# Altium project Power_Box_V2.PrjPcb (part 2 of 2)

## Sheet ISD1730.SchDoc
size A; SheetNumber: 5; SheetTotal: 13
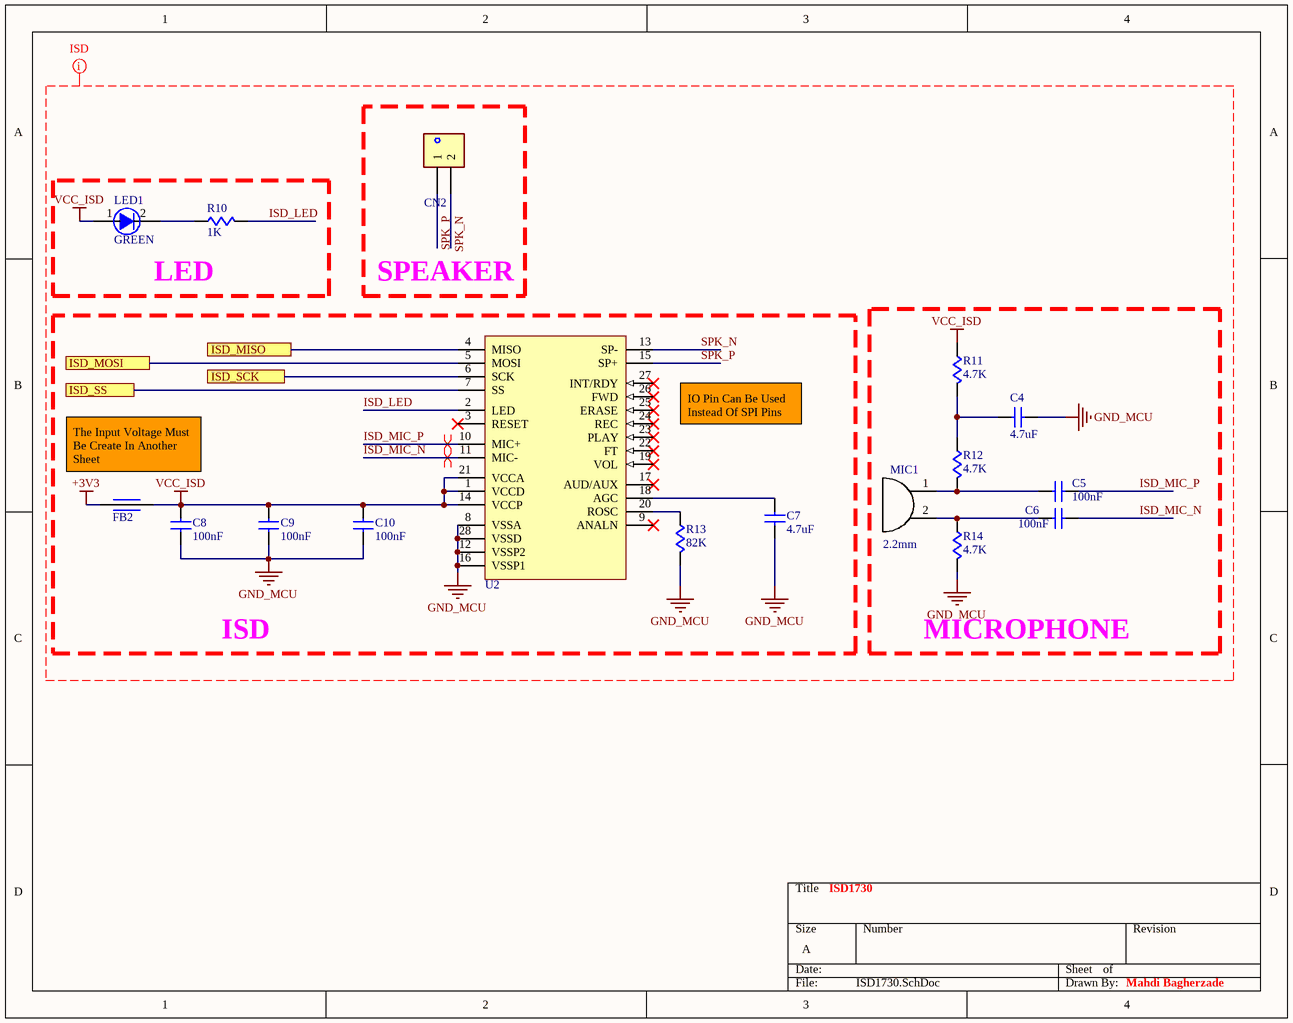
[diagram p10: ISD1730.SchDoc]

### Parts
C4  value 4.7uF  [C-0805]  (hidden comment: CAP Cer 4.7uF-50V-X7R-SMD)
C5  value 100nF  [C-0805]  (hidden comment: CAP Cer 100nF-50V-X7R-SMD)
C6  value 100nF  [C-0805]  (hidden comment: CAP Cer 100nF-50V-X7R-SMD)
C7  value 4.7uF  [C-0805]  (hidden comment: CAP Cer 4.7uF-50V-X7R-SMD)
C8  value 100nF  [C-0805]  (hidden comment: CAP Cer 100nF-50V-X7R-SMD)
C9  value 100nF  [C-0805]  (hidden comment: CAP Cer 100nF-50V-X7R-SMD)
C10  value 100nF  [C-0805]  (hidden comment: CAP Cer 100nF-50V-X7R-SMD)
CN2  Connector XH-2-Straight-THD-2.54mm  [XH-2]  (value not drawn)
FB2  Ferrite Bead SMD  [FB-0805]  (value not drawn)
LED1  Color: GREEN  [LED-1206-Y]  (hidden comment: LED GREEN-1206-SMD)
MIC1  Size: 2.2mm  [MIC-2.2mm]  (hidden comment: Mic 2.2mm-THD)
R10  value 1K  [R-0805]  (hidden comment: RES 1K-5%-1/8W-SMD)
R11  value 4.7K  [R-0805]  (hidden comment: RES 4.7K-5%-1/8W-SMD)
R12  value 4.7K  [R-0805]  (hidden comment: RES 4.7K-5%-1/8W-SMD)
R13  value 82K  [R-0805]  (hidden comment: RES 82K-5%-1/8W-SMD)
R14  value 4.7K  [R-0805]  (hidden comment: RES 4.7K-5%-1/8W-SMD)
U2  IC ISD1730-SMD  [SOIC28-wide]  (value not drawn)

### Blocks framed on the sheet
SPEAKER: CN2
LED: LED1 R10
ISD: C7-C10 FB2 R13 U2
MICROPHONE: C4-C6 MIC1 R11 R12 R14

### Ports
ISD_MISO (see Interface[3B]), ISD_MOSI (see Interface[3B]), ISD_SCK (see Interface[3B]), ISD_SS (see Interface[3B], MCU[3C])

### Nets
+3V3: FB2.1
GND_MCU: C4.2 C7.2 C8.2 C9.2 C10.2 R13.2 R14.2 U2.8(VSSA) U2.12(VSSP2) U2.16(VSSP1) U2.28(VSSD)
VCC_ISD: C8.1 C9.1 C10.1 FB2.2 LED1.1(A) R11.1 U2.1(VCCD) U2.14(VCCP) U2.21(VCCA)
ISD_LED: R10.2 U2.2(LED)
ISD_MIC_N: C6.2 U2.11(MIC-)
ISD_MIC_P: C5.2 U2.10(MIC+)
SPK_N: CN2.2 U2.13(SP-)
SPK_P: CN2.1 U2.15(SP+)
NetC4_1: C4.1 R11.2 R12.1
NetC5_1: C5.1 MIC1.1 R12.2
NetC6_1: C6.1 MIC1.2 R14.1
NetC7_1: C7.1 U2.18(AGC)
NetLED1_2: LED1.2(C) R10.1
NetR13_1: R13.1 U2.20(ROSC)
NetU2_4: U2.4(MISO) ; port ISD_MISO
NetU2_5: U2.5(MOSI) ; port ISD_MOSI
NetU2_6: U2.6(SCK) ; port ISD_SCK
NetU2_7: U2.7(SS) ; port ISD_SS

Not connected (* = marked no-connect by the designer): U2 3(RESET)* 9(ANALN)* 17(AUD/AUX)* 19(VOL)* 22(FT)* 23(PLAY)* 24(REC)* 25(ERASE)* 26(FWD)* 27(INT/RDY)*

### Layout directives
differential pair: ISD_MIC_N, ISD_MIC_P
net class ISD: +3V3, GND_MCU, ISD_LED, ISD_MIC_N, ISD_MIC_P, SPK_N, SPK_P, VCC_ISD

### Notes on the sheet
- IO Pin Can Be Used Instead Of SPI Pins
- The Input Voltage Must Be Create In Another Sheet
- ISD1730
- Mahdi Bagherzade

### Library data of the parts
C4-C10 = CAP-CER: CAPACITOR; Phone Number: 0915 8700 314; Voltage: 50V; Tolerance: X7R; Type: SMD; Publisher: Mahdi Bagherzadeh; ComponentLink1Description: Linkedin; ComponentLink1URL: https://ir.linkedin.com/in/mahdi-bagherzade; Published Date: 9-15-2024
CN2 = CN-2pin: CONNECTOR; Phone Number: 0915 8700 314; Value: XH-2; Publisher: Mahdi Bagherzadeh; ComponentLink1Description: Linkedin; ComponentLink1URL: https://ir.linkedin.com/in/mahdi-bagherzade; Published Date: 9-15-2024; Size: 2.54mm; Type: Straight-THD
FB2 = FERRITE BEAD: INDUCATOR; Phone Number: 0915 8700 314; Publisher: Mahdi Bagherzadeh; ComponentLink1Description: Linkedin; ComponentLink1URL: https://ir.linkedin.com/in/mahdi-bagherzade; Published Date: 9-15-2024; Type: SMD
LED1 = LED: Phone Number: 0915 8700 314; Type: SMD; Publisher: Mahdi Bagherzadeh; ComponentLink1Description: Linkedin; ComponentLink1URL: https://ir.linkedin.com/in/mahdi-bagherzade; Published Date: 9-15-2024; Size: 1206
MIC1 = MIC: Phone Number: 0915 8700 314; Publisher: Mahdi Bagherzadeh; ComponentLink1Description: Linkedin; ComponentLink1URL: https://ir.linkedin.com/in/mahdi-bagherzade; Published Date: 9-15-2024; Type: THD
R10-R14 = RES: RESISTOR; Phone Number: 0915 8700 314; Power: 1/8W; Tolerance: 5%; Publisher: Mahdi Bagherzadeh; ComponentLink1Description: Linkedin; ComponentLink1URL: https://ir.linkedin.com/in/mahdi-bagherzade; Published Date: 9-15-2024; Type: SMD
U2 = ISD1730: IC; Phone Number: 0915 8700 314; Publisher: Mahdi Bagherzadeh; ComponentLink1Description: Linkedin; ComponentLink1URL: https://ir.linkedin.com/in/mahdi-bagherzade; Published Date: 9-15-2024; Code: ISD1730; Type: SMD

## Sheet IS42S16400J.SchDoc
size A; SheetNumber: 11; SheetTotal: 12
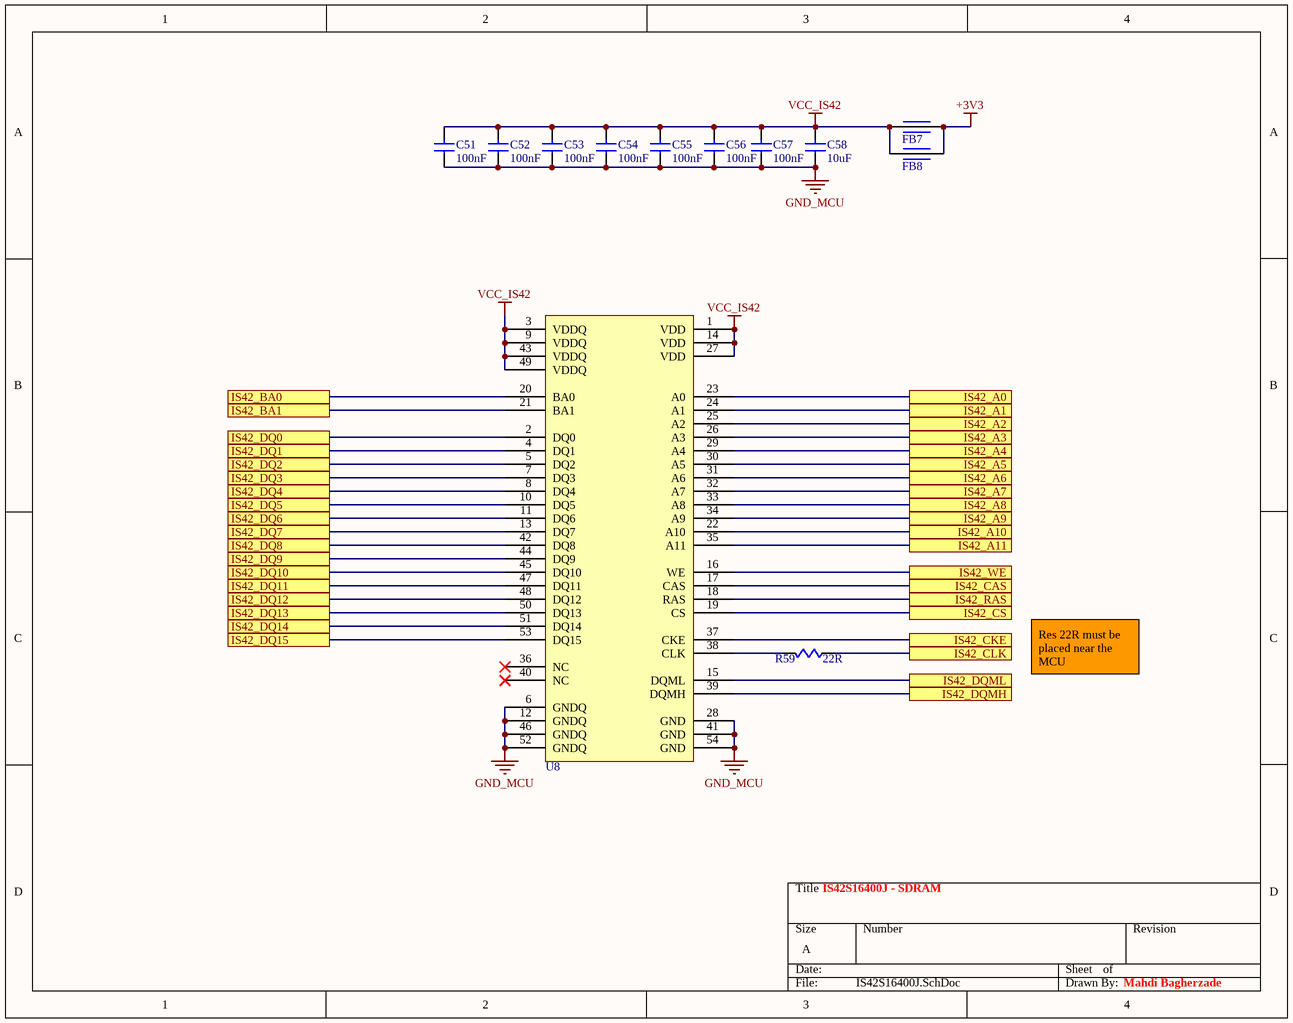
[diagram p11: IS42S16400J.SchDoc]

### Parts
C51  value 100nF  [C-0805]  (hidden comment: CAP Cer 100nF-50V-X7R-SMD)
C52  value 100nF  [C-0805]  (hidden comment: CAP Cer 100nF-50V-X7R-SMD)
C53  value 100nF  [C-0805]  (hidden comment: CAP Cer 100nF-50V-X7R-SMD)
C54  value 100nF  [C-0805]  (hidden comment: CAP Cer 100nF-50V-X7R-SMD)
C55  value 100nF  [C-0805]  (hidden comment: CAP Cer 100nF-50V-X7R-SMD)
C56  value 100nF  [C-0805]  (hidden comment: CAP Cer 100nF-50V-X7R-SMD)
C57  value 100nF  [C-0805]  (hidden comment: CAP Cer 100nF-50V-X7R-SMD)
C58  value 10uF  [C-0805]  (hidden comment: CAP Cer 10uF-50V-X7R-SMD)
FB7  Ferrite Bead SMD  [FB-0805]  (value not drawn)
FB8  Ferrite Bead SMD  [FB-0805]  (value not drawn)
R59  value 22R  [R-0805]  (hidden comment: RES 22R-5%-1/8W-SMD)
U8  IC IS42S16400J-7TLI-SMD  [TSSOP-54]  (value not drawn)

### Ports
IS42_A0 (see Interface[3C], MCU[5B]), IS42_A1 (see Interface[3C], MCU[5B]), IS42_A2 (see Interface[3D], MCU[5B]), IS42_A3 (see Interface[3D], MCU[5B]), IS42_A4 (see Interface[3D], MCU[5B]), IS42_A5 (see Interface[3D], MCU[5B]), IS42_A6 (see Interface[3D], MCU[5C]), IS42_A7 (see Interface[3D], MCU[5C]), IS42_A8 (see Interface[3D], MCU[5C]), IS42_A9 (see Interface[3D], MCU[5C]), IS42_A10 (see Interface[3D], MCU[3C]), IS42_A11 (see Interface[3D], MCU[3C]), IS42_BA0 (see Interface[3C], MCU[3C]), IS42_BA1 (see Interface[3C], MCU[3C]), IS42_CAS (see Interface[3D], MCU[3C]), IS42_CKE (see Interface[3D], MCU[3B]), IS42_CLK (see Interface[3D], MCU[3C]), IS42_CS (see Interface[3D], MCU[3B]), IS42_DQ0 (see Interface[3C], MCU[5B]), IS42_DQ1 (see Interface[3C], MCU[5B]), IS42_DQ2 (see Interface[3C], MCU[5A]), IS42_DQ3 (see Interface[3C], MCU[5A]), IS42_DQ4 (see Interface[3C], MCU[3B]), IS42_DQ5 (see Interface[3C], MCU[3C]), IS42_DQ6 (see Interface[3C], MCU[3C]), IS42_DQ7 (see Interface[3C], MCU[3C]), IS42_DQ8 (see Interface[3C], MCU[3C]), IS42_DQ9 (see Interface[3C], MCU[3C]), IS42_DQ10 (see Interface[3C], MCU[3C]), IS42_DQ11 (see Interface[3C], MCU[3C]), IS42_DQ12 (see Interface[3C], MCU[3C]), IS42_DQ13 (see Interface[3C], MCU[5B]), IS42_DQ14 (see Interface[3C], MCU[5B]), IS42_DQ15 (see Interface[3C], MCU[5B]), IS42_DQMH (see Interface[3D], MCU[3B]), IS42_DQML (see Interface[3D], MCU[3B]), IS42_RAS (see Interface[3D], MCU[5C]), IS42_WE (see Interface[3D], MCU[3A])

### Nets
+3V3: FB7.1 FB8.1
GND_MCU: C51.1 C52.1 C53.1 C54.1 C55.1 C56.1 C57.1 C58.1 U8.6(GNDQ) U8.12(GNDQ) U8.28(GND) U8.41(GND) U8.46(GNDQ) U8.52(GNDQ) U8.54(GND)
VCC_IS42: C51.2 C52.2 C53.2 C54.2 C55.2 C56.2 C57.2 C58.2 FB7.2 FB8.2 U8.1(VDD) U8.3(VDDQ) U8.9(VDDQ) U8.14(VDD) U8.27(VDD) U8.43(VDDQ) U8.49(VDDQ)
NetR59_1: R59.1 ; port IS42_CLK
NetR59_2: R59.2 U8.38(CLK)
NetU3_10: U8.23(A0) ; port IS42_A0
NetU3_11: U8.24(A1) ; port IS42_A1
NetU3_12: U8.25(A2) ; port IS42_A2
NetU3_13: U8.26(A3) ; port IS42_A3
NetU3_14: U8.29(A4) ; port IS42_A4
NetU3_15: U8.30(A5) ; port IS42_A5
NetU3_26: U8.16(WE) ; port IS42_WE
NetU3_28: U8.19(CS) ; port IS42_CS
NetU3_29: U8.37(CKE) ; port IS42_CKE
NetU3_49: U8.18(RAS) ; port IS42_RAS
NetU3_50: U8.31(A6) ; port IS42_A6
NetU3_53: U8.32(A7) ; port IS42_A7
NetU3_54: U8.33(A8) ; port IS42_A8
NetU3_55: U8.34(A9) ; port IS42_A9
NetU3_56: U8.22(A10) ; port IS42_A10
NetU3_57: U8.35(A11) ; port IS42_A11
NetU3_58: U8.8(DQ4) ; port IS42_DQ4
NetU3_59: U8.10(DQ5) ; port IS42_DQ5
NetU3_60: U8.11(DQ6) ; port IS42_DQ6
NetU3_63: U8.13(DQ7) ; port IS42_DQ7
NetU3_64: U8.42(DQ8) ; port IS42_DQ8
NetU3_65: U8.44(DQ9) ; port IS42_DQ9
NetU3_66: U8.45(DQ10) ; port IS42_DQ10
NetU3_67: U8.47(DQ11) ; port IS42_DQ11
NetU3_68: U8.48(DQ12) ; port IS42_DQ12
NetU3_77: U8.50(DQ13) ; port IS42_DQ13
NetU3_78: U8.51(DQ14) ; port IS42_DQ14
NetU3_79: U8.53(DQ15) ; port IS42_DQ15
NetU3_85: U8.2(DQ0) ; port IS42_DQ0
NetU3_86: U8.4(DQ1) ; port IS42_DQ1
NetU3_89: U8.21(BA1) ; port IS42_BA1
NetU3_90: U8.20(BA0) ; port IS42_BA0
NetU3_114: U8.5(DQ2) ; port IS42_DQ2
NetU3_115: U8.7(DQ3) ; port IS42_DQ3
NetU3_132: U8.17(CAS) ; port IS42_CAS
NetU3_141: U8.15(DQML) ; port IS42_DQML
NetU3_142: U8.39(DQMH) ; port IS42_DQMH

Not connected (* = marked no-connect by the designer): U8 36(NC)* 40(NC)*

### Notes on the sheet
- Res 22R must be placed near the MCU
- IS42S16400J - SDRAM
- Mahdi Bagherzade

### Library data of the parts
C51-C58 = CAP-CER: as C4 on sheet ISD1730; Publisher: Mahdi Bagherzadeh; ComponentLink1Description: Linkedin; ComponentLink1URL: https://ir.linkedin.com/in/mahdi-bagherzade; Published Date: 9-15-2024
FB7 FB8 = FERRITE BEAD: INDUCATOR; Phone Number: 0915 8700 314; Publisher: Mahdi Bagherzadeh; ComponentLink1Description: Linkedin; ComponentLink1URL: https://ir.linkedin.com/in/mahdi-bagherzade; Published Date: 9-15-2024; Type: SMD
R59 = RES: as R10 on sheet ISD1730; Publisher: Mahdi Bagherzadeh; ComponentLink1Description: Linkedin; ComponentLink1URL: https://ir.linkedin.com/in/mahdi-bagherzade; Published Date: 9-15-2024; Type: SMD
U8 = IS42S16400J-7TLI: IC; Phone Number: 0915 8700 314; Publisher: Mahdi Bagherzadeh; ComponentLink1Description: Linkedin; ComponentLink1URL: https://ir.linkedin.com/in/mahdi-bagherzade; Published Date: 9-15-2024; Code: IS42S16400J-7TLI; Type: SMD

## Sheet Touch XPT2046.SchDoc
size A; SheetNumber: 12; SheetTotal: 13
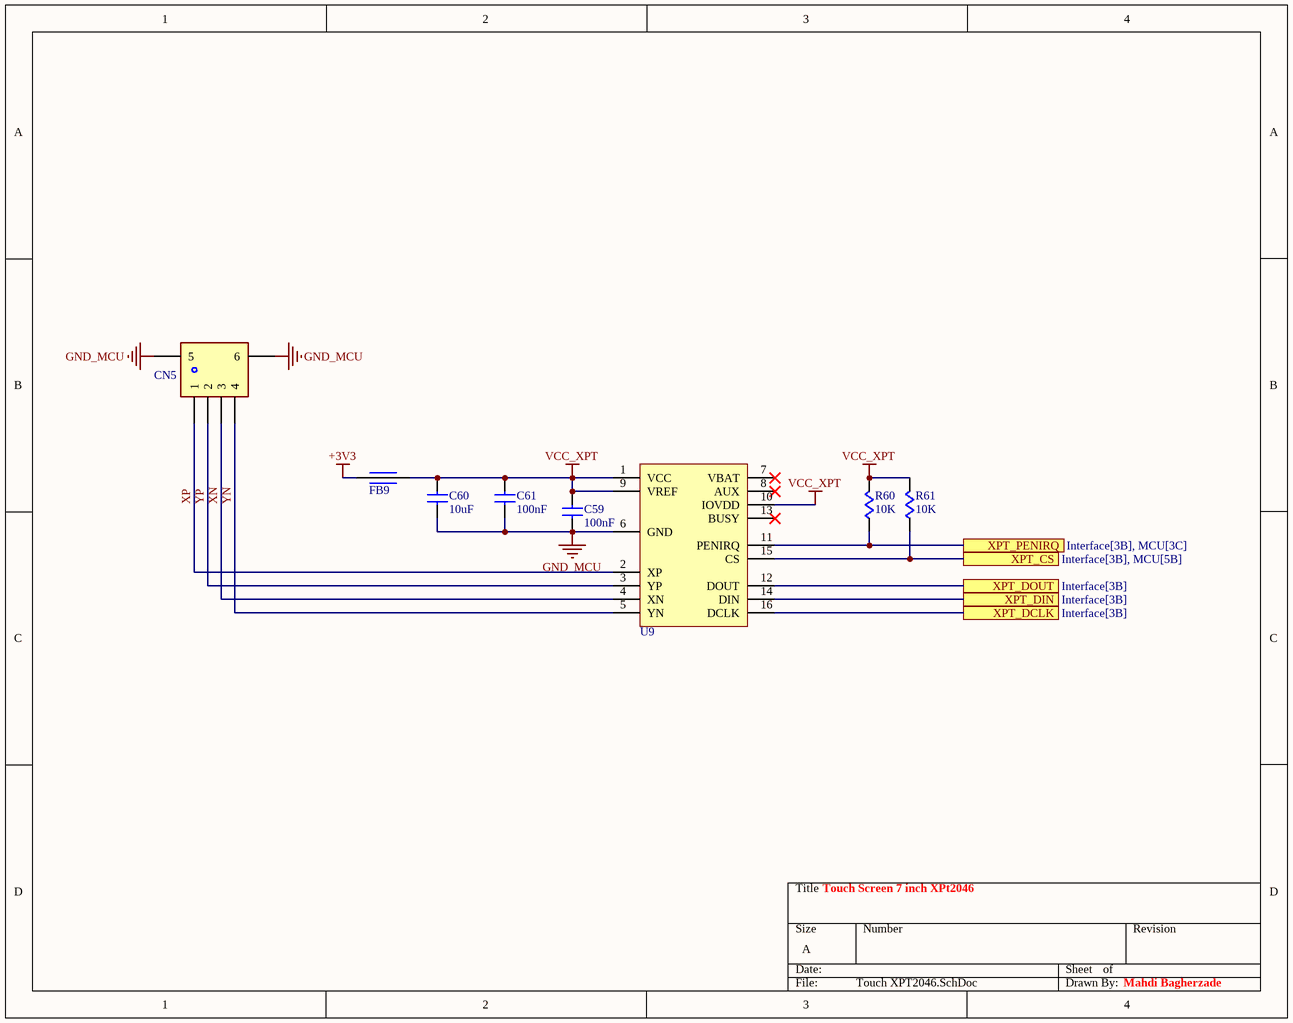
[diagram p12: Touch XPT2046.SchDoc]

### Parts
C59  value 100nF  [C-0805]  (hidden comment: CAP Cer 100nF-50V-X7R-SMD)
C60  value 10uF  [C-0805]  (hidden comment: CAP Cer 10uF-50V-X7R-SMD)
C61  value 100nF  [C-0805]  (hidden comment: CAP Cer 100nF-50V-X7R-SMD)
CN5  Connector FPC Right-1mm-4 Pin  [CN-FPC-4-1mm-hor]  (value not drawn)
FB9  Ferrite Bead SMD  [FB-0805]  (value not drawn)
R60  value 10K  [R-0805]  (hidden comment: RES 10K-5%-1/8W-SMD)
R61  value 10K  [R-0805]  (hidden comment: RES 10K-5%-1/8W-SMD)
U9  IC XPT2046-SMD  [TSSOP-16]  (value not drawn)

### Ports
XPT_CS (see Interface[3B], MCU[5B]), XPT_DCLK (see Interface[3B]), XPT_DIN (see Interface[3B]), XPT_DOUT (see Interface[3B]), XPT_PENIRQ (see Interface[3B], MCU[3C])

### Nets
+3V3: FB9.1
GND_MCU: C59.2 C60.2 C61.2 CN5.5 CN5.6 U9.6(GND)
VCC_XPT: C59.1 C60.1 C61.1 FB9.2 R60.2 R61.2 U9.1(VCC) U9.9(VREF) U9.10(IOVDD)
XN: CN5.3 U9.4(XN)
XP: CN5.1 U9.2(XP)
YN: CN5.4 U9.5(YN)
YP: CN5.2 U9.3(YP)
NetR60_1: R60.1 U9.11(PENIRQ) ; port XPT_PENIRQ
NetR61_1: R61.1 U9.15(CS) ; port XPT_CS
NetU2_4: U9.12(DOUT) ; port XPT_DOUT
NetU2_5: U9.14(DIN) ; port XPT_DIN
NetU2_6: U9.16(DCLK) ; port XPT_DCLK

Not connected (* = marked no-connect by the designer): U9 7(VBAT)* 8(AUX)* 13(BUSY)*

### Notes on the sheet
- Touch Screen 7 inch XPt2046
- Mahdi Bagherzade

### Library data of the parts
C59-C61 = CAP-CER: as C4 on sheet ISD1730; Publisher: Mahdi Bagherzadeh; ComponentLink1Description: Linkedin; ComponentLink1URL: https://ir.linkedin.com/in/mahdi-bagherzade; Published Date: 9-15-2024
CN5 = CN-FPC-4pin: CONNECTOR; Phone Number: 0915 8700 314; Publisher: Mahdi Bagherzadeh; ComponentLink1Description: Linkedin; ComponentLink1URL: https://ir.linkedin.com/in/mahdi-bagherzade; Published Date: 9-15-2024; Size: 1mm-4 Pin; Type: Right
FB9 = FERRITE BEAD: INDUCATOR; Phone Number: 0915 8700 314; Publisher: Mahdi Bagherzadeh; ComponentLink1Description: Linkedin; ComponentLink1URL: https://ir.linkedin.com/in/mahdi-bagherzade; Published Date: 9-15-2024; Type: SMD
R60 R61 = RES: as R10 on sheet ISD1730; Publisher: Mahdi Bagherzadeh; ComponentLink1Description: Linkedin; ComponentLink1URL: https://ir.linkedin.com/in/mahdi-bagherzade; Published Date: 9-15-2024; Type: SMD
U9 = XPT2046: IC; Phone Number: 0915 8700 314; Publisher: Mahdi Bagherzadeh; ComponentLink1Description: Linkedin; ComponentLink1URL: https://ir.linkedin.com/in/mahdi-bagherzade; Published Date: 9-15-2024; Code: XPT2046; Type: SMD

## Nets that join several sheets
+3V3: STM32_AUX (6 pins), LCD TFT 50 Pin (FB3.1), W25Q32 (FB6.1), EEPROM (FB1.2), KEY1 (R1A.1), KEY2 (R1B.1), ISD1730 (FB2.1), IS42S16400J (FB7.1 FB8.1), Touch XPT2046 (FB9.1)
+5: Interface (C41.1 C42.1 CN4.3), STM32_AUX (C33.2 C34.2 U4.1), Power (C44.1 C46.1 LED4.1 U5.3), MC3202 (C47.1 L1.1 U6.6)
+12: Power (C43.1 C45.1 D3.2 U5.1), CHANNEL1 (CN1A.3 D1A.2 R6A.1), CHANNEL2 (CN1B.3 D1B.2 R6B.1), CHANNEL3 (CN1C.3 D1C.2 R6C.1), CHANNEL4 (CN1D.3 D1D.2 R6D.1), CHANNEL5 (CN1E.3 D1E.2 R6E.1), CHANNEL6 (CN1F.3 D1F.2 R6F.1), CHANNEL7 (CN1G.3 D1G.2 R6G.1), CHANNEL8 (CN1H.3 D1H.2 R6H.1)
GND: Interface (NT1.1), MC3202 (6 pins)
GND_MCU: Interface (6 pins), MCU (10 pins), STM32_AUX (32 pins), LCD TFT 50 Pin (18 pins), W25Q32 (C50.1 U7.4), EEPROM (6 pins), KEY1 (C1A.2 S1A.1), KEY2 (C1B.2 S1B.1), Power (7 pins), CHANNEL1 (7 pins), CHANNEL2 (7 pins), CHANNEL3 (7 pins), CHANNEL4 (7 pins), CHANNEL5 (7 pins), CHANNEL6 (7 pins), CHANNEL7 (7 pins), CHANNEL8 (7 pins), MC3202 (C49.2), ISD1730 (11 pins), IS42S16400J (15 pins), Touch XPT2046 (6 pins)
VCC_MCU: MCU (15 pins), STM32_AUX (19 pins)
LTDC_B2: MCU (U3.122), LCD TFT 50 Pin (CN3.17)
LTDC_B3: MCU (U3.126), LCD TFT 50 Pin (CN3.16)
LTDC_B4: MCU (U3.127), LCD TFT 50 Pin (CN3.15)
LTDC_B5: MCU (U3.37), LCD TFT 50 Pin (CN3.14)
LTDC_B6: MCU (U3.139), LCD TFT 50 Pin (CN3.13)
LTDC_B7: MCU (U3.140), LCD TFT 50 Pin (CN3.12)
LTDC_CLK: MCU (U3.92), LCD TFT 50 Pin (R43.1)
LTDC_DE: MCU (U3.22), LCD TFT 50 Pin (R16.1)
LTDC_G2: MCU (U3.42), LCD TFT 50 Pin (CN3.25)
LTDC_G3: MCU (U3.125), LCD TFT 50 Pin (CN3.24)
LTDC_G4: MCU (U3.69), LCD TFT 50 Pin (CN3.23)
LTDC_G5: MCU (U3.70), LCD TFT 50 Pin (CN3.22)
LTDC_G6: MCU (U3.97), LCD TFT 50 Pin (CN3.21)
LTDC_G7: MCU (U3.117), LCD TFT 50 Pin (CN3.20)
LTDC_HSYNC: MCU (U3.96), LCD TFT 50 Pin (R18.1)
LTDC_R2: MCU (U3.111), LCD TFT 50 Pin (CN3.33)
LTDC_R3: MCU (U3.46), LCD TFT 50 Pin (CN3.32)
LTDC_R4: MCU (U3.103), LCD TFT 50 Pin (CN3.31)
LTDC_R5: MCU (U3.104), LCD TFT 50 Pin (CN3.30)
LTDC_R6: MCU (U3.47), LCD TFT 50 Pin (CN3.29)
LTDC_R7: MCU (U3.91), LCD TFT 50 Pin (CN3.28)
LTDC_RST: MCU (U3.98), LCD TFT 50 Pin (C11.2 R44.1 R45.1)
LTDC_VSYNC: MCU (U3.40), LCD TFT 50 Pin (R17.1)
MCU_BOOT0: MCU (U3.138), STM32_AUX (H2.2)
MCU_BOOT1: MCU (U3.48), STM32_AUX (H3.2)
MCU_NRST: MCU (U3.25), STM32_AUX (C15.2 R46.1 S2.2)
MCU_OCS_N: MCU (U3.23), STM32_AUX (C16.2 Y1.1)
MCU_OCS_P: MCU (U3.24), STM32_AUX (C17.2 Y1.2)
MCU_RXD: Interface (CN4.4), MCU (U3.102)
MCU_SCL: MCU (U3.100), EEPROM (R8.2 U1.6)
MCU_SDA: MCU (U3.99), EEPROM (R9.2 U1.5)
MCU_SWCLK: MCU (U3.109), STM32_AUX (H1.3)
MCU_SWDIO: MCU (U3.105), STM32_AUX (H1.1)
MCU_TXD: Interface (CN4.5), MCU (U3.101)
MCU_VBAT: MCU (U3.6), STM32_AUX (BAT1.1 C38.2 C39.2 D2.2)
NetLED3_1: Interface (LED3.1), MCU (U3.5)
NetR56_1: MCU (U3.129), W25Q32 (R56.1 U7.1)
NetR59_1: MCU (U3.93), IS42S16400J (R59.1)
NetR60_1: MCU (U3.124), Touch XPT2046 (R60.1 U9.11)
NetR61_1: MCU (U3.123), Touch XPT2046 (R61.1 U9.15)
NetU2_4: MCU (U3.134), W25Q32 (U7.2), ISD1730 (U2.4), Touch XPT2046 (U9.12)
NetU2_5: MCU (U3.135), W25Q32 (U7.5), ISD1730 (U2.5), Touch XPT2046 (U9.14)
NetU2_6: MCU (U3.133), W25Q32 (U7.6), ISD1730 (U2.6), Touch XPT2046 (U9.16)
NetU2_7: MCU (U3.128), ISD1730 (U2.7)
NetU3_10: MCU (U3.10), IS42S16400J (U8.23)
NetU3_11: MCU (U3.11), IS42S16400J (U8.24)
NetU3_12: MCU (U3.12), IS42S16400J (U8.25)
NetU3_13: MCU (U3.13), IS42S16400J (U8.26)
NetU3_14: MCU (U3.14), IS42S16400J (U8.29)
NetU3_15: MCU (U3.15), IS42S16400J (U8.30)
NetU3_26: MCU (U3.26), IS42S16400J (U8.16)
NetU3_28: MCU (U3.28), IS42S16400J (U8.19)
NetU3_29: MCU (U3.29), IS42S16400J (U8.37)
NetU3_49: MCU (U3.49), IS42S16400J (U8.18)
NetU3_50: MCU (U3.50), IS42S16400J (U8.31)
NetU3_53: MCU (U3.53), IS42S16400J (U8.32)
NetU3_54: MCU (U3.54), IS42S16400J (U8.33)
NetU3_55: MCU (U3.55), IS42S16400J (U8.34)
NetU3_56: MCU (U3.56), IS42S16400J (U8.22)
NetU3_57: MCU (U3.57), IS42S16400J (U8.35)
NetU3_58: MCU (U3.58), IS42S16400J (U8.8)
NetU3_59: MCU (U3.59), IS42S16400J (U8.10)
NetU3_60: MCU (U3.60), IS42S16400J (U8.11)
NetU3_63: MCU (U3.63), IS42S16400J (U8.13)
NetU3_64: MCU (U3.64), IS42S16400J (U8.42)
NetU3_65: MCU (U3.65), IS42S16400J (U8.44)
NetU3_66: MCU (U3.66), IS42S16400J (U8.45)
NetU3_67: MCU (U3.67), IS42S16400J (U8.47)
NetU3_68: MCU (U3.68), IS42S16400J (U8.48)
NetU3_77: MCU (U3.77), IS42S16400J (U8.50)
NetU3_78: MCU (U3.78), IS42S16400J (U8.51)
NetU3_79: MCU (U3.79), IS42S16400J (U8.53)
NetU3_85: MCU (U3.85), IS42S16400J (U8.2)
NetU3_86: MCU (U3.86), IS42S16400J (U8.4)
NetU3_89: MCU (U3.89), IS42S16400J (U8.21)
NetU3_90: MCU (U3.90), IS42S16400J (U8.20)
NetU3_114: MCU (U3.114), IS42S16400J (U8.5)
NetU3_115: MCU (U3.115), IS42S16400J (U8.7)
NetU3_132: MCU (U3.132), IS42S16400J (U8.17)
NetU3_141: MCU (U3.141), IS42S16400J (U8.15)
NetU3_142: MCU (U3.142), IS42S16400J (U8.39)
V_CAP_1: MCU (U3.71), STM32_AUX (C32.1)
V_CAP_2: MCU (U3.106), STM32_AUX (C37.1)
V_LED+: LCD TFT 50 Pin (CN3.1 CN3.2), MC3202 (C48.1 C49.1 D4.2 U6.5)
V_LED-: LCD TFT 50 Pin (CN3.3 CN3.4), MC3202 (R54.1 R55.1 U6.3)